# EAGLE design ksz8999-evm-dip-replacement (EAGLE 6.4)
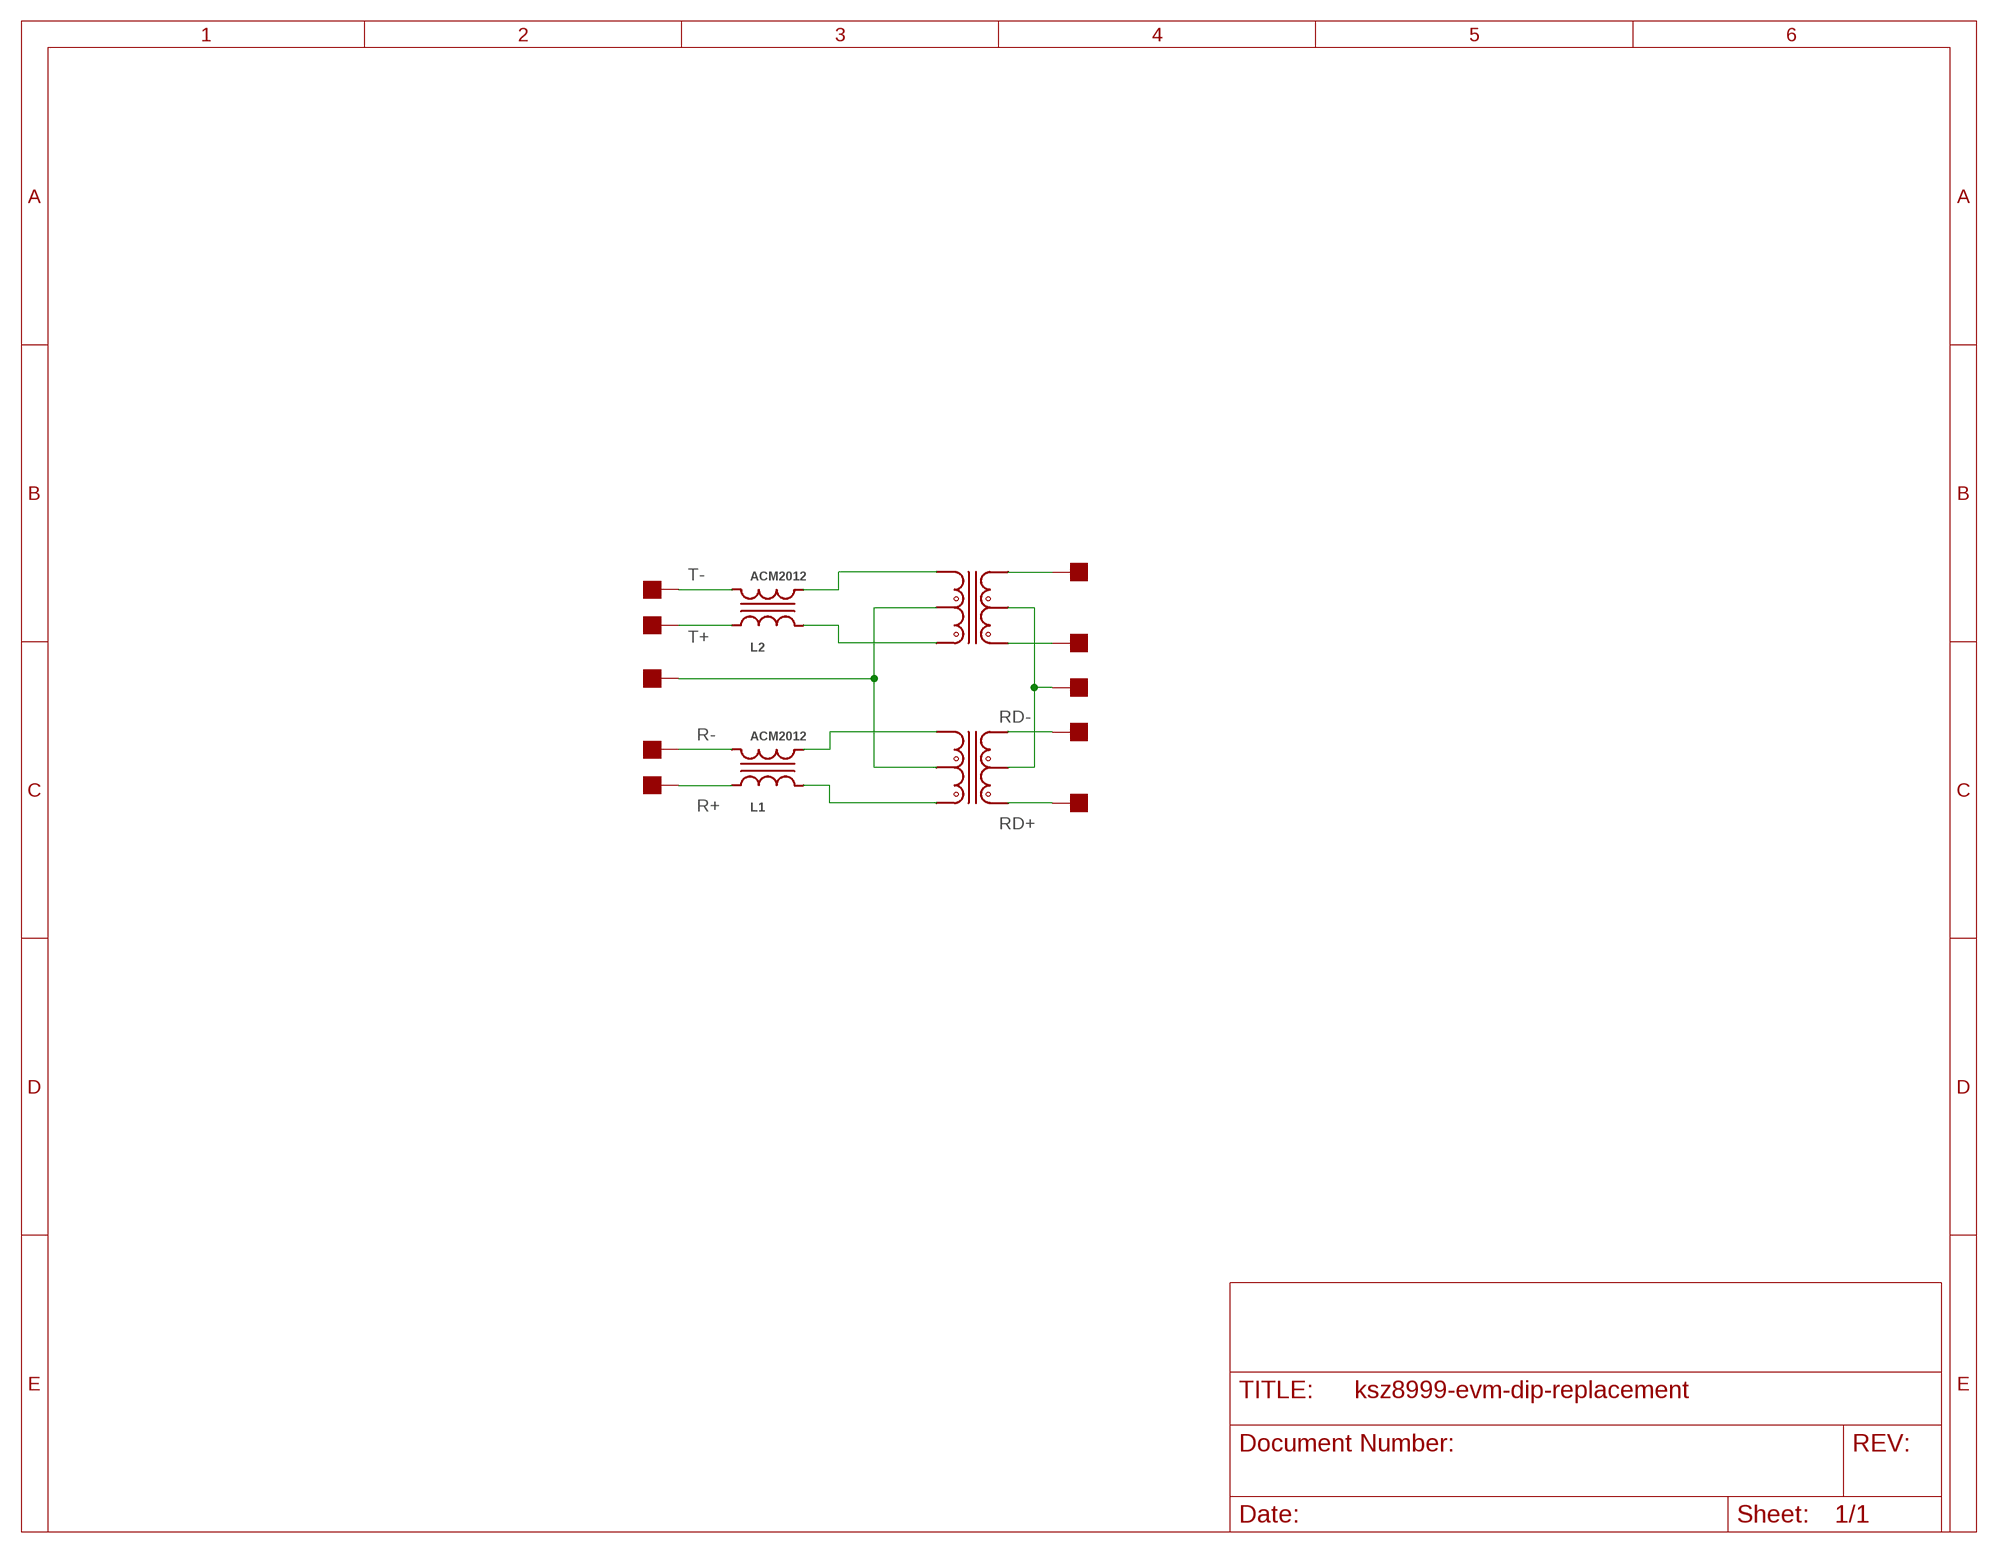
[diagram p0: schematic, sheet 1]

## Parts
L1  ACM2012  [TDK-ACM2012]
L2  ACM2012  [TDK-ACM2012]
T1  ALT4532  [TDK-ALT4532]
T2  ALT4532  [TDK-ALT4532]
TP1  TEST-PAD  [TEST-PAD]
TP2  TEST-PAD  [TEST-PAD]
TP3  TEST-PAD  [TEST-PAD]
TP4  TEST-PAD  [TEST-PAD]
TP6  TEST-PAD  [TEST-PAD]
TP7  TEST-PAD  [TEST-PAD]
TP8  TEST-PAD  [TEST-PAD]
TP9  TEST-PAD  [TEST-PAD]
TP10  TEST-PAD  [TEST-PAD]
TP11  TEST-PAD  [TEST-PAD]

## Nets
N$1: L1.3 T1.4
N$2: L2.4 T2.5
N$3: T2.1 TP3.P$1
N$4: T1.6 T2.6 TP2.P$1
N$5: L1.4 T1.5
N$6: T2.2 TP1.P$1
N$7: T1.2 TP4.P$1
N$10: T1.1 TP6.P$1
N$11: L1.2 TP10.P$1
N$12: L1.1 TP11.P$1
N$13: L2.1 TP8.P$1
N$14: L2.3 T2.4
N$15: L2.2 TP7.P$1
N$26: T1.3 T2.3 TP9.P$1

## Notes on the sheet
- T-
- T+
- RD-
- R-
- R+
- RD+

## Library data of the parts
L1 L2 = magnetics:ACM2012
T1 T2 = alt4532:ALT4532
TP1-TP4 TP6-TP11 = iron_evm:TEST-PAD

## Board
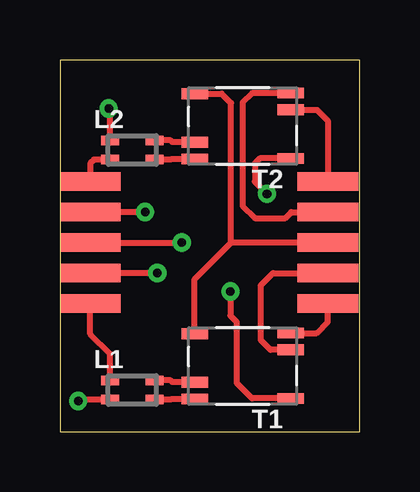
[diagram p1: board, top side]
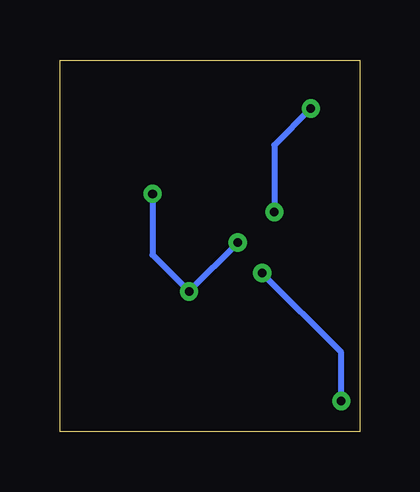
[diagram p2: board, bottom side, seen from below]

Size 12.5 x 15.48 mm. Coordinates in mm from the lower left corner, seen from the top.
Outline: 0,0 12.5,0 12.5,15.48 0,15.48 0,0
Copper layers (1*16): Top 0.0178mm / dielectric 59mil / Bottom 0.0178mm
Design rules "epl-lpkf": minimum track width 8mil, minimum drill 0.35mm, track to track 8mil, track to pad 8mil, pad to pad 8mil, via to via 8mil, smd to smd 8mil, copper to edge 15mil, drill to drill 15mil, minimum pad ring 8mil, minimum via ring 8mil, stop-mask expansion 3mil, vias tented up to drill 0mil, thermal gap 10mil

### Footprints (pad centres in the part's own frame; a part is rotated, then mirrored left to right if it is on the bottom)
TDK-ACM2012 = smd 0.75 x 0.4: 1 -0.925,0.4; 2 -0.925,-0.4; 3 0.925,-0.4; 4 0.925,0.4
TDK-ALT4532 = smd 1.1 x 0.45: 1 -2,-1.375; 2 -2,-0.675; 3 -2,1.35; 4 2,1.375; 5 2,0.675; 6 2,-1.35
TEST-PAD = smd 2.54 x 0.762: P$1 0,0

### Placement (x,y rotation side)
L1  3.02,1.73 0 top
L2  3.02,11.73 0 top
T1  7.62,2.73 180 top
T2  7.62,12.73 180 top
TP1  11.18,10.41 0 top
TP2  11.18,7.87 0 top
TP3  11.18,9.14 0 top
TP4  11.18,6.6 0 top
TP6  11.18,5.33 0 top
TP7  1.27,10.41 0 top
TP8  1.27,9.14 0 top
TP9  1.27,7.87 0 top
TP10  1.27,6.6 0 top
TP11  1.27,5.33 0 top

### Tracks (layer width: path | path; a pad name or v marks a point on that pad's centre or on a via)
N$1
  Top 0.254: T1.4 4.64,1.36 4.62,1.33 L1.3
N$2
  Top 0.254: T2.5 4.7,12.06 4.62,12.13 L2.4
N$3
  Top 0.254: T2.1 8.01,14.11 7.62,13.72 7.62,9.4 8.13,8.89 9.4,8.89 9.65,9.14 TP3.P$1
N$4
  Top 0.254: TP2.P$1 7.14,7.87 | T2.6 6.75,14.08 7.14,13.68 7.14,7.87 | 7.14,7.87 5.62,6.35 T1.6
N$5
  Top 0.254: T1.5 4.7,2.06 4.62,2.13 L1.4
N$6
  Top 0.254: T2.2 10.72,13.41 11.18,12.95 TP1.P$1
N$7
  Top 0.254: T1.2 8.79,3.41 8.38,3.81 8.38,6.1 8.89,6.6 TP4.P$1
N$10
  Top 0.254: T1.1 10.71,4.11 11.18,4.57 TP6.P$1
N$11  (via drill 0.36)
  Top 0.254: L1.2 0.82,1.33 v0.76,1.27 | v4.06,6.6 TP10.P$1
  Bottom 0.254: v0.76,1.27 0.76,3.3 v4.06,6.6
N$12
  Top 0.254: L1.1 2.1,3.24 1.27,4.06 TP11.P$1
N$13  (via drill 0.36)
  Top 0.254: L2.1 2.1,13.4 v2.03,13.46 | v3.56,9.14 TP8.P$1
  Bottom 0.254: v2.03,13.46 3.56,11.94 v3.56,9.14
N$14
  Top 0.254: T2.4 4.64,11.36 4.62,11.33 L2.3
N$15
  Top 0.254: L2.2 1.43,11.33 1.27,11.18 TP7.P$1
N$26  (via drill 0.36)
  Top 0.254: T1.3 8.02,1.38 7.37,2.03 7.37,4.57 7.11,4.83 v7.11,5.84 | TP9.P$1 v5.08,7.87 | T2.3 8.33,11.38 8.13,11.18 8.13,10.41 v8.64,9.91
  Bottom 0.254: v5.08,7.87 v7.11,5.84 8.64,7.37 v8.64,9.91